# Altium project Z03.PrjPcb
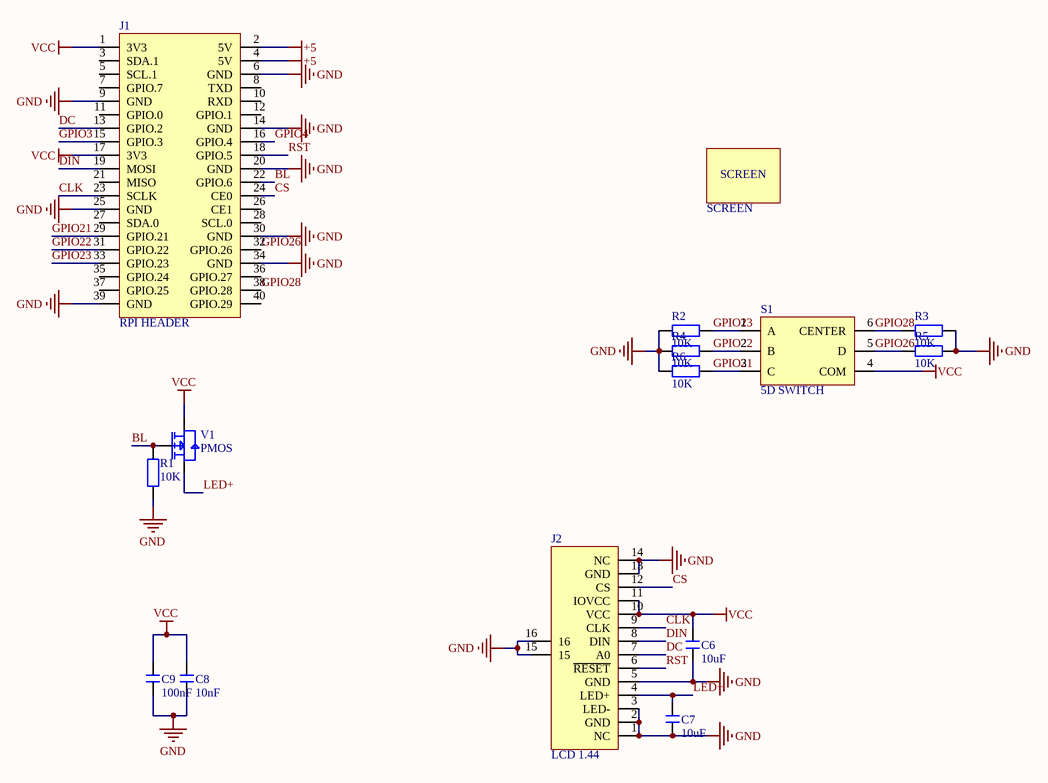
[diagram p0: Sheet1.SchDoc]
1 sheet, 15 parts. Net scope: global (net labels, ports and power ports of the same name join across sheets).
Board file: PCB1.PcbDoc

## Sheet Sheet1.SchDoc
size A4; SheetNumber: 1; SheetTotal: 1

### Parts
C6  10uF  [C 0603_M]
C7  10uF  [C 0603_M]
C8  10nF  [C 0603_M]
C9  100nF  [C 0603_M]
J1  RPI HEADER  [HEADER 2*20 SMD BACK]
J2  LCD 1.44  [FPC-14PIN-0.5]
R1  10K  [R 0603-HP]
R2  10K  [R 0603-HP]
R3  10K  [R 0603-HP]
R4  10K  [R 0603-HP]
R5  10K  [R 0603-HP]
R6  10K  [R 0603-HP]
S1  5D SWITCH  [5D SWITCH]
S2  SCREEN  [SCREEN]
V1  PMOS  [SOT-23]

### Nets
+5: J1.2(5V) J1.4(5V)
GND: C6.1 C7.2 C8.1 C9.1 J1.6(GND) J1.9(GND) J1.14(GND) J1.20(GND) J1.25(GND) J1.30(GND) J1.34(GND) J1.39(GND) J2.1(NC) J2.2(GND) J2.3(LED-) J2.5(GND) J2.13(GND) J2.14(NC) J2.15 J2.16 R1.2 R2.1 R3.2 R4.1 R5.2 R6.1
VCC: C6.2 C8.2 C9.2 J1.1(3V3) J1.17(3V3) J2.10(VCC) J2.11(IOVCC) S1.4(COM) V1.2(S)
BL: J1.22(GPIO.6) R1.1 V1.1(G)
CLK: J1.23(SCLK) J2.9(CLK)
CS: J1.24(CE0) J2.12(CS)
DC: J1.13(GPIO.2) J2.7(A0)
DIN: J1.19(MOSI) J2.8(DIN)
GPIO3: J1.15(GPIO.3)
GPIO4: J1.16(GPIO.4)
GPIO21: J1.29(GPIO.21) R6.2 S1.3(C)
GPIO22: J1.31(GPIO.22) R4.2 S1.2(B)
GPIO23: J1.33(GPIO.23) R2.2 S1.1(A)
GPIO26: J1.32(GPIO.26) R5.1 S1.5(D)
GPIO28: J1.38(GPIO.28) R3.1 S1.6(CENTER)
LED+: C7.1 J2.4(LED+) V1.3(D)
RST: J1.18(GPIO.5) J2.6(~{RESET})

Not connected (* = marked no-connect by the designer): J1 3(SDA.1) 5(SCL.1) 7(GPIO.7) 8(TXD) 10(RXD) 11(GPIO.0) 12(GPIO.1) 21(MISO) 26(CE1) 27(SDA.0) 28(SCL.0) 35(GPIO.24) 36(GPIO.27) 37(GPIO.25) 40(GPIO.29)

### Library data of the parts
C6-C9 = C: 无极性贴片电容; BOM名称: 无极性贴片电容
R1-R6 = R: 贴片电阻; 版权归属: 源创客; BOM名称: 贴片电阻; 学习资源: www.ooocke.com